# Altium schematic sheet 07_Programming_Reset.SchDoc: Programming / Reset
size A; Revision: A; SheetNumber: 7; SheetTotal: 8; ECE315_Project_Name: ECE453 MCU Base Project
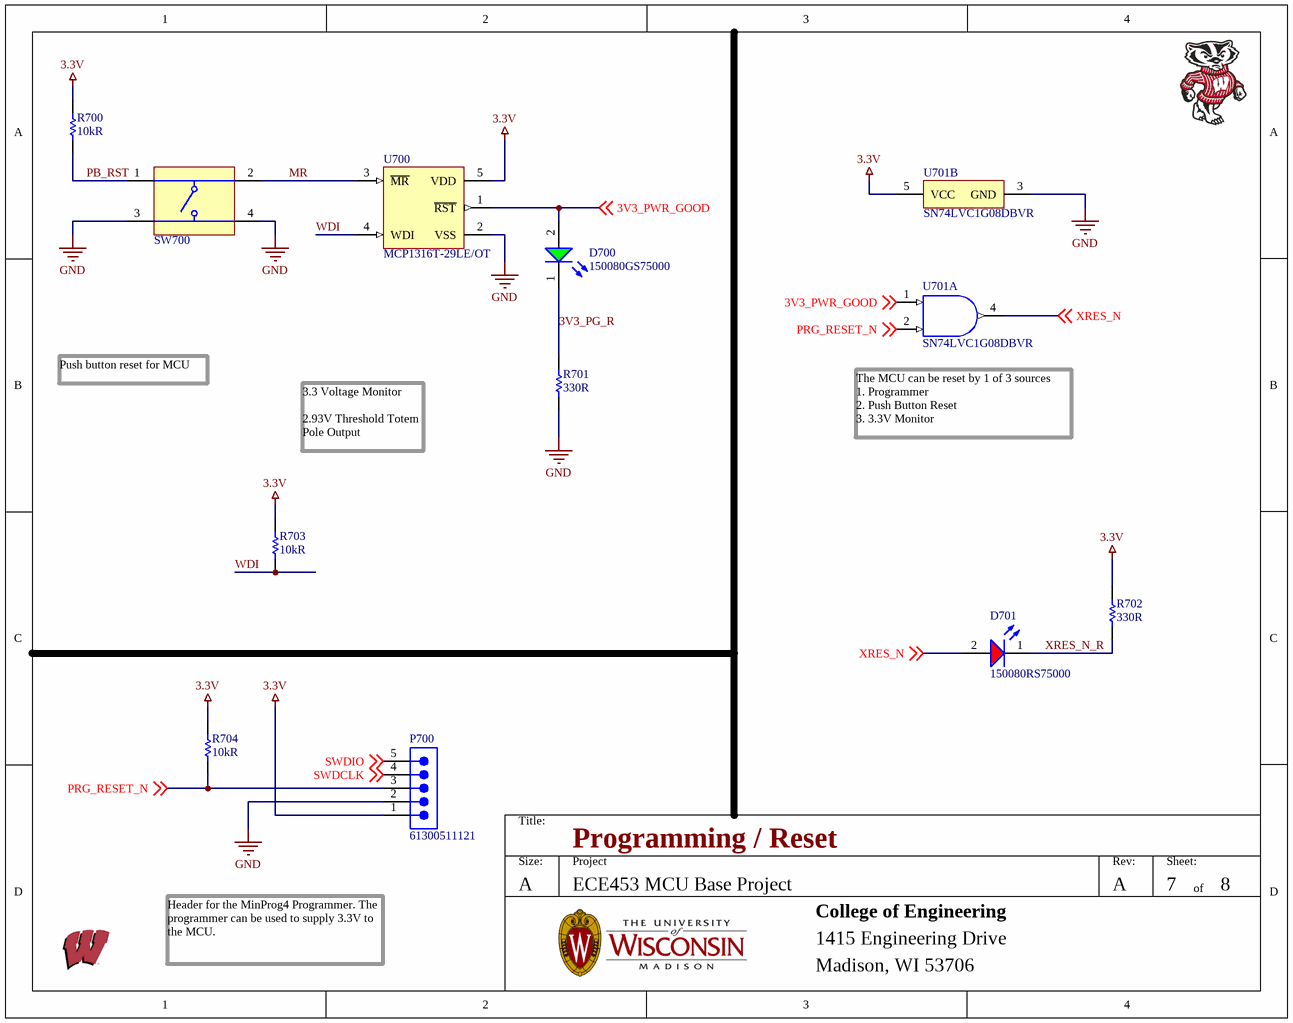
[diagram p0: 07_Programming_Reset.SchDoc]

## Parts
D700  150080GS75000  [WL-SMCW_0805_150080xx75000]
D701  150080RS75000  [WL-SMCW_0805_150080xx75000]
P700  61300511121  [61300511121]
R700  10kR  [RESC2013X70X40ML20T20]
R701  330R  [RESC2013X60X40LL20T25]
R702  330R  [RESC2013X60X40LL20T25]
R703  10kR  [RESC2013X70X40ML20T20]
R704  10kR  [RESC2013X70X40ML20T20]
SW700  (no value)  [TECO-FSM4JSMA_V]
U700  MCP1316T-29LE/OT  [SOT-23-OT5_M]
U701  SN74LVC1G08DBVR  [DBV0005A_M]  (parts A,B of 2)

## Nets
3.3V: P700.1 R700.2 R702.1 R703.2 R704.2 U700.5(VDD) U701.5(VCC)
GND: P700.2 R701.2 SW700.3 SW700.4 U700.2(VSS) U701.3(GND)
3V3_PG_R: D700.1(K) R701.1
3V3_PWR_GOOD: D700.2(A) U700.1(~{RST}) U701.1(A) ; off-sheet 3V3_PWR_GOOD
MR: SW700.2 U700.3(~{MR})
PB_RST: R700.1 SW700.1
PRG_RESET_N: P700.3 R704.1 U701.2(B) ; off-sheet PRG_RESET_N
SWDCLK: P700.4 ; off-sheet SWDCLK
SWDIO: P700.5 ; off-sheet SWDIO
WDI: R703.1 U700.4(WDI)
XRES_N: D701.2(A) U701.4(Y) ; off-sheet XRES_N
XRES_N_R: D701.1(K) R702.2

## Notes on the sheet
- Push button reset for MCU
- (near U701) The MCU can be reset by 1 of 3 sources
  1. Programmer
  2. Push Button Reset
  3. 3.3V Monitor
- 3.3 Voltage Monitor
  2.93V Threshold Totem Pole Output
- Header for the MinProg4 Programmer. The programmer can be used to supply 3.3V to the MCU.
- Title:
- Size:
- A
- Project
- Rev:
- Sheet:
- of
- College of Engineering
- 1415 Engineering Drive
- Madison, WI 53706

## Library data of the parts
D700 = CMP-1426-00007-2: NexarPartId: 29717780; Wavelength: 520nm; Forward Current: 100mA; Lens Style: Clear, Rectangular; Dominant Wavelength: 525nm; Max Junction Temperature (Tj): 95°C; Power Dissipation: 105mW; Luminous Intensity: 450mcd; Peak Wavelength: 515nm; Color: Green; Viewing Angle: 140°; Test Current: 20mA; Reverse Voltage: 5V; Forward Voltage: 3.2V; Mount: Surface Mount; REACH SVHC: Unknown; Min Operating Temperature: -40°C; Case Code (Imperial): 0805; Case/Package: 0805; Max Operating Temperature: 85°C; RoHS: Compliant; Length: 2mm; Height: 700µm; Width: 1.25mm; Case Code (Metric): 2012; Packaging: Tape and Reel; Max Reverse Voltage (DC): 5V
D701 = CMP-1426-00011-2: NexarPartId: 29717781; Peak Wavelength: 630nm; Wavelength: 625nm; Viewing Angle: 140°; Test Current: 20mA; Forward Voltage: 2V; Forward Current: 100mA; Lens Style: Clear, Rectangular; Color: Red; Luminous Intensity: 150mcd; Max Reverse Voltage (DC): 5V; Length: 2mm; Case Code (Imperial): 0805; RoHS: Compliant; Max Operating Temperature: 85°C; Height: 700µm; Packaging: Tape and Reel; Case/Package: 0805; REACH SVHC: Unknown; Dominant Wavelength: 625nm; Min Operating Temperature: -40°C; Case Code (Metric): 2012; Mount: Surface Mount; Width: 1.25mm
P700 = CMP-1502-01068-2: NexarPartId: 32855526; Operating Supply Voltage: 250V; Number of Contacts: 5; Connector Type: Male Pin; Current Rating: 3A; Contact Resistance: 20mΩ; Pitch: 2.54mm; Gender: Male; Termination: Solder; RoHS: Compliant; Lead Pitch: 2.54mm; Contact Mating Length: 5.9944mm; Number of Positions: 5; Lead Free: Lead Free; Contact Plating: Gold; Number of Pins: 5; Min Operating Temperature: -40°C; Voltage Rating: 250V; Color: Black; Mount: Through Hole; REACH SVHC: Unknown; Packaging: Bulk; Height: 8.89mm; Number of Rows: 1; Orientation: Vertical; Contact Material: Copper; Max Operating Temperature: 105°C
R700 R703 R704 = CMP-2001-04376-1: Manufacturer: Panasonic; Part Number: ERJ-6ENF1002V
R701 R702 = CMP-2001-00628-1: Manufacturer: Panasonic; Part Number: ERA6AEB331V
SW700 = CMP-2000-05602-2: Swicth, SPST, 24 V, -35 to 85 degC, 4-Pin SMD, RoHS, Tape and Reel; Manufacturer: TE Connectivity; Switch Travel: 0.25mm; Mechanical Life: 100000Cycles; Contact Current Rating: 50mA; Operating Force: 1.57N; Actuator Material: Polyamide; Contact Resistance: 100mOhm; Voltage Rating: 24V; Illumination Type: Illuminated; Actuator Length: 0.055inch; Max Voltage Rating (DC): 12V; Case\/Package: SMD/SMT; Orientation: Straight; Datasheet URL: http://www.te.com/commerce/DocumentDelivery/DDEController?Action=showdoc&DocId=Customer+Drawing%7F2-1437565-7%7FV%7Fpdf%7FEnglish%7FENG_CD_2-1437565-7_V.pdf%7F4-1437565-2; Min Operating Temperature: -35degC; Packaging: LoosePiece; Termination: GullWing; Throw Configuration: SPST; Package Description: 4-Pin Surface Mount Device, Body 6 x 6 mm, Pitch 4.5 mm; Mounting Technology: SurfaceMount; Contact Plating: Silver; Datasheet Version: Rev. V, 02/2015; RoHSCompliant: true; Max Operating Temperature: 85degC; Length: 6mm; Voltage Rating (DC): 24V; Electrical Life: 100000Cycles; Current Rating: 50mA; Package Quantity: 750; Mount: SurfaceMount; Package Reference: FSM4JSMA; Manufacturer URL: http://www.te.com/; Width: 6mm; REACH SVHC: Unknown; Contact Material: CopperAlloy
U700 = CMP-0138-00207-1: Voltage Supervisor, 5-Pin SOT-23, Extended Temperature, Tape and Reel; PackageReference: SOT-23-OT5; Code_IPC: SOT23-5; DatasheetVersion: revB, Oct-2007; PackageDescription: 5-Lead Plastic Small Outline Transistor (OT) [SOT-23]; PackageVersion: revBB, Aug-2009
U701 = CMP-0859-00053-3: Single 2-Input Positive-AND Gate, DBV0005A, LARGE T&R; Manufacturer: Texas Instruments; Logic: True; ICC @ Nom Voltage(Max)(mA): 0.01; VCC(Min)(V): 1.65; Bits(#): 1; Rating: Catalog; Schmitt Trigger: No; Voltage(Nom)(V): 1.8,2.5,3.3,5; Output Drive (IOL/IOH)(Max)(mA): 32/-32; Gate Type: AND; tpd @ Nom Voltage(Max)(ns): 4.5,6,4,5; VCC(Max)(V): 5.5; Output Type: CMOS; F @ Nom Voltage(Max)(Mhz): 150; Input Type: CMOS/TTL; Technology Family: LVC; Sub-Family: AND Gate; PackageReference: DBV0005A; Generic Part Number: SN74LVC1G08; Operating Temperature Range(C): -40 to 125,-40 to 85; 3-State Output: No; DatasheetVersion: SCES217Y